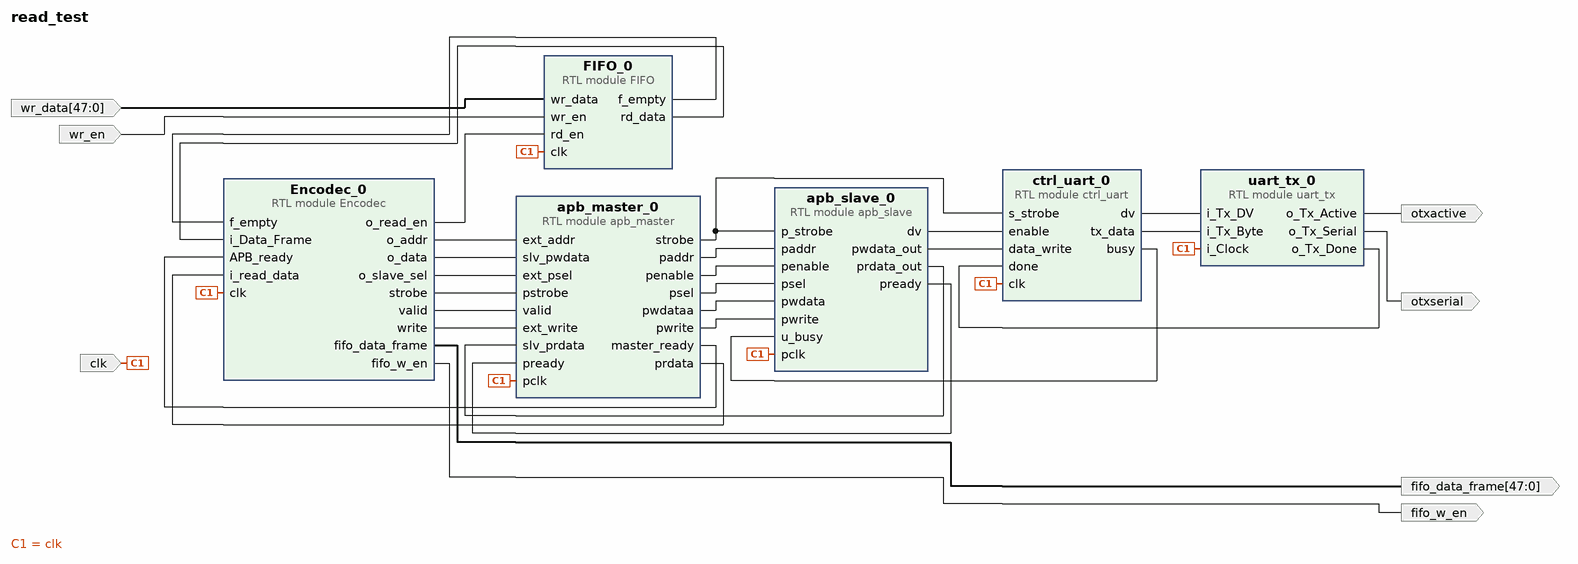
[diagram p0: block diagram of the top level]
# Vivado block design read_test, xc7z010iclg225-1L, Vivado 2023.2
create_bd_design read_test

create_bd_port -dir I clk
create_bd_port -dir O otxactive
create_bd_port -dir O otxserial
create_bd_port -dir I wr_en
create_bd_port -dir I -from 47 -to 0 wr_data
create_bd_port -dir O -from 47 -to 0 fifo_data_frame
create_bd_port -dir O fifo_w_en

create_bd_cell -type module -reference Encodec Encodec_0
create_bd_cell -type module -reference apb_master apb_master_0
create_bd_cell -type module -reference apb_slave apb_slave_0
create_bd_cell -type module -reference ctrl_uart ctrl_uart_0
create_bd_cell -type module -reference uart_tx uart_tx_0
create_bd_cell -type module -reference FIFO FIFO_0

# ---- connections ----

connect_bd_net [get_bd_pins Encodec_0/fifo_data_frame] [get_bd_ports fifo_data_frame]
connect_bd_net [get_bd_pins Encodec_0/fifo_w_en] [get_bd_ports fifo_w_en]
connect_bd_net [get_bd_pins Encodec_0/o_addr] [get_bd_pins apb_master_0/ext_addr]
connect_bd_net [get_bd_pins Encodec_0/o_data] [get_bd_pins apb_master_0/slv_pwdata]
connect_bd_net [get_bd_pins Encodec_0/o_read_en] [get_bd_pins FIFO_0/rd_en]
connect_bd_net [get_bd_pins Encodec_0/o_slave_sel] [get_bd_pins apb_master_0/ext_psel]
connect_bd_net [get_bd_pins Encodec_0/strobe] [get_bd_pins apb_master_0/pstrobe]
connect_bd_net [get_bd_pins Encodec_0/valid] [get_bd_pins apb_master_0/valid]
connect_bd_net [get_bd_pins Encodec_0/write] [get_bd_pins apb_master_0/ext_write]
connect_bd_net [get_bd_pins FIFO_0/f_empty] [get_bd_pins Encodec_0/f_empty]
connect_bd_net [get_bd_pins FIFO_0/rd_data] [get_bd_pins Encodec_0/i_Data_Frame]
connect_bd_net [get_bd_pins apb_master_0/master_ready] [get_bd_pins Encodec_0/APB_ready]
connect_bd_net [get_bd_pins apb_master_0/paddr] [get_bd_pins apb_slave_0/paddr]
connect_bd_net [get_bd_pins apb_master_0/penable] [get_bd_pins apb_slave_0/penable]
connect_bd_net [get_bd_pins apb_master_0/prdata] [get_bd_pins Encodec_0/i_read_data]
connect_bd_net [get_bd_pins apb_master_0/psel] [get_bd_pins apb_slave_0/psel]
connect_bd_net [get_bd_pins apb_master_0/pwdataa] [get_bd_pins apb_slave_0/pwdata]
connect_bd_net [get_bd_pins apb_master_0/pwrite] [get_bd_pins apb_slave_0/pwrite]
connect_bd_net [get_bd_pins apb_master_0/strobe] [get_bd_pins ctrl_uart_0/s_strobe] [get_bd_pins apb_slave_0/p_strobe]
connect_bd_net [get_bd_pins apb_slave_0/dv] [get_bd_pins ctrl_uart_0/enable]
connect_bd_net [get_bd_pins apb_slave_0/prdata_out] [get_bd_pins apb_master_0/slv_prdata]
connect_bd_net [get_bd_pins apb_slave_0/pready] [get_bd_pins apb_master_0/pready]
connect_bd_net [get_bd_pins apb_slave_0/pwdata_out] [get_bd_pins ctrl_uart_0/data_write]
connect_bd_net [get_bd_ports clk] \
  [get_bd_pins ctrl_uart_0/clk] [get_bd_pins uart_tx_0/i_Clock] [get_bd_pins apb_master_0/pclk] \
  [get_bd_pins apb_slave_0/pclk] [get_bd_pins FIFO_0/clk] [get_bd_pins Encodec_0/clk]
connect_bd_net [get_bd_pins ctrl_uart_0/busy] [get_bd_pins apb_slave_0/u_busy]
connect_bd_net [get_bd_pins ctrl_uart_0/dv] [get_bd_pins uart_tx_0/i_Tx_DV]
connect_bd_net [get_bd_pins ctrl_uart_0/tx_data] [get_bd_pins uart_tx_0/i_Tx_Byte]
connect_bd_net [get_bd_pins uart_tx_0/o_Tx_Active] [get_bd_ports otxactive]
connect_bd_net [get_bd_pins uart_tx_0/o_Tx_Done] [get_bd_pins ctrl_uart_0/done]
connect_bd_net [get_bd_pins uart_tx_0/o_Tx_Serial] [get_bd_ports otxserial]
connect_bd_net [get_bd_ports wr_data] [get_bd_pins FIFO_0/wr_data]
connect_bd_net [get_bd_ports wr_en] [get_bd_pins FIFO_0/wr_en]

validate_bd_design
save_bd_design
